# EAGLE design QEDTiny (EAGLE 6.1)
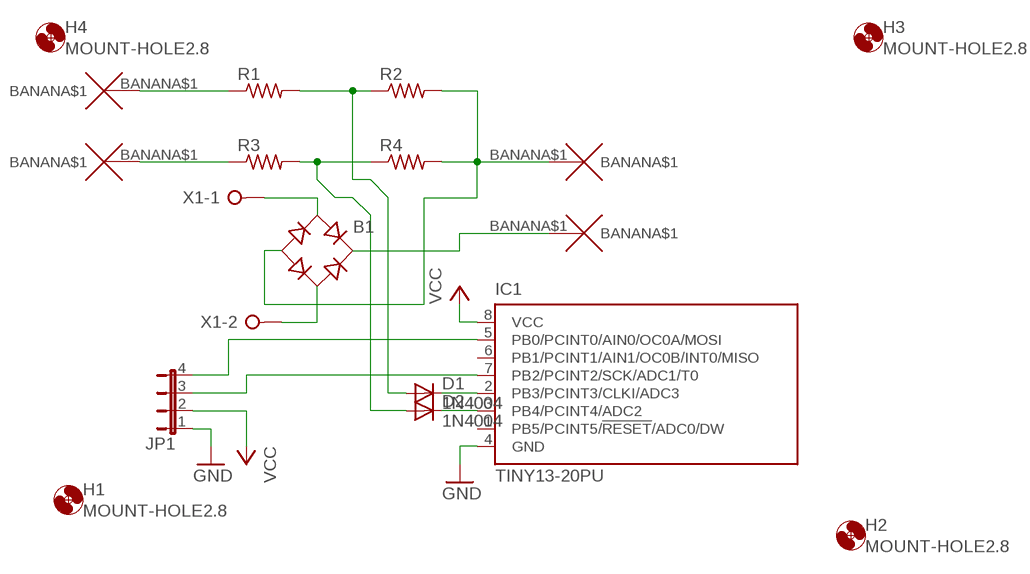
[diagram p0: schematic, sheet 1]

## Parts
B1  RB1A  [RB1A]
D1  1N4004  [DO41-10]
D2  1N4004  [DO41-10]
H1  MOUNT-HOLE2.8  [2,8]
H2  MOUNT-HOLE2.8  [2,8]
H3  MOUNT-HOLE2.8  [2,8]
H4  MOUNT-HOLE2.8  [2,8]
IC1  TINY13-20PU  [DIL08]
JP1  JP4E  [JP4]
R1  R-US_0207/7  [0207/7]
R2  R-US_0207/7  [0207/7]
R3  R-US_0207/7  [0207/7]
R4  R-US_0207/7  [0207/7]
U$1  BANANA  [BANANA]
U$2  BANANA  [BANANA]
U$3  BANANA  [BANANA]
U$4  BANANA  [BANANA]
X1  W237-02P  [W237-132]

## Nets
GND: IC1.4(GND) JP1.1
N$1: IC1.7(PB2/PCINT2/SCK/ADC1/T0) JP1.3
N$2: IC1.5(PB0/PCINT0/AIN0/OC0A/MOSI) JP1.4
N$3: R1.1 U$3.BANANA$1
N$4: R3.1 U$4.BANANA$1
N$5: D1.A R1.2 R2.1
N$6: D2.A R3.2 R4.1
N$7: B1.- R2.2 R4.2 U$2.BANANA$1
N$8: B1.AC1 X1.1
N$9: B1.AC2 X1.2
N$10: B1.+ U$1.BANANA$1
N$11: D1.C IC1.2(PB3/PCINT3/CLKI/ADC3)
N$12: D2.C IC1.3(PB4/PCINT4/ADC2)
VCC: IC1.8(VCC) JP1.2
Unconnected: IC1.1(PB5/PCINT5/!RESET!/ADC0/DW) IC1.6(PB1/PCINT1/AIN1/OC0B/INT0/MISO)

## Library data of the parts
B1 = rectifier:RB1A: RECTIFIER 1 A
D1 D2 = diode:1N4004: DIODE general purpose rectifier, 1 A
H1-H4 = holes:MOUNT-HOLE: MOUNTING HOLE with drill center marker
IC1 = atmel:TINY13: 8-bit AVR Microcontroller with 1K Bytes In-System Programmable Flash Source: http://www.atmel.com/dyn/resources/prod_documents/2535S.pdf; MPN: ATTINY13-20PU; OC_FARNELL: 9171550; OC_NEWARK: 96K6521
JP1 = jumper:JP4E: JUMPER
R1-R4 = rcl:R-US_: RESISTOR, American symbol
U$1-U$4 = wirepad:BANANA
X1 = con-wago-508:W237-02P: WAGO SREW CLAMP; OC_FARNELL: unknown; OC_NEWARK: unknown

## Board
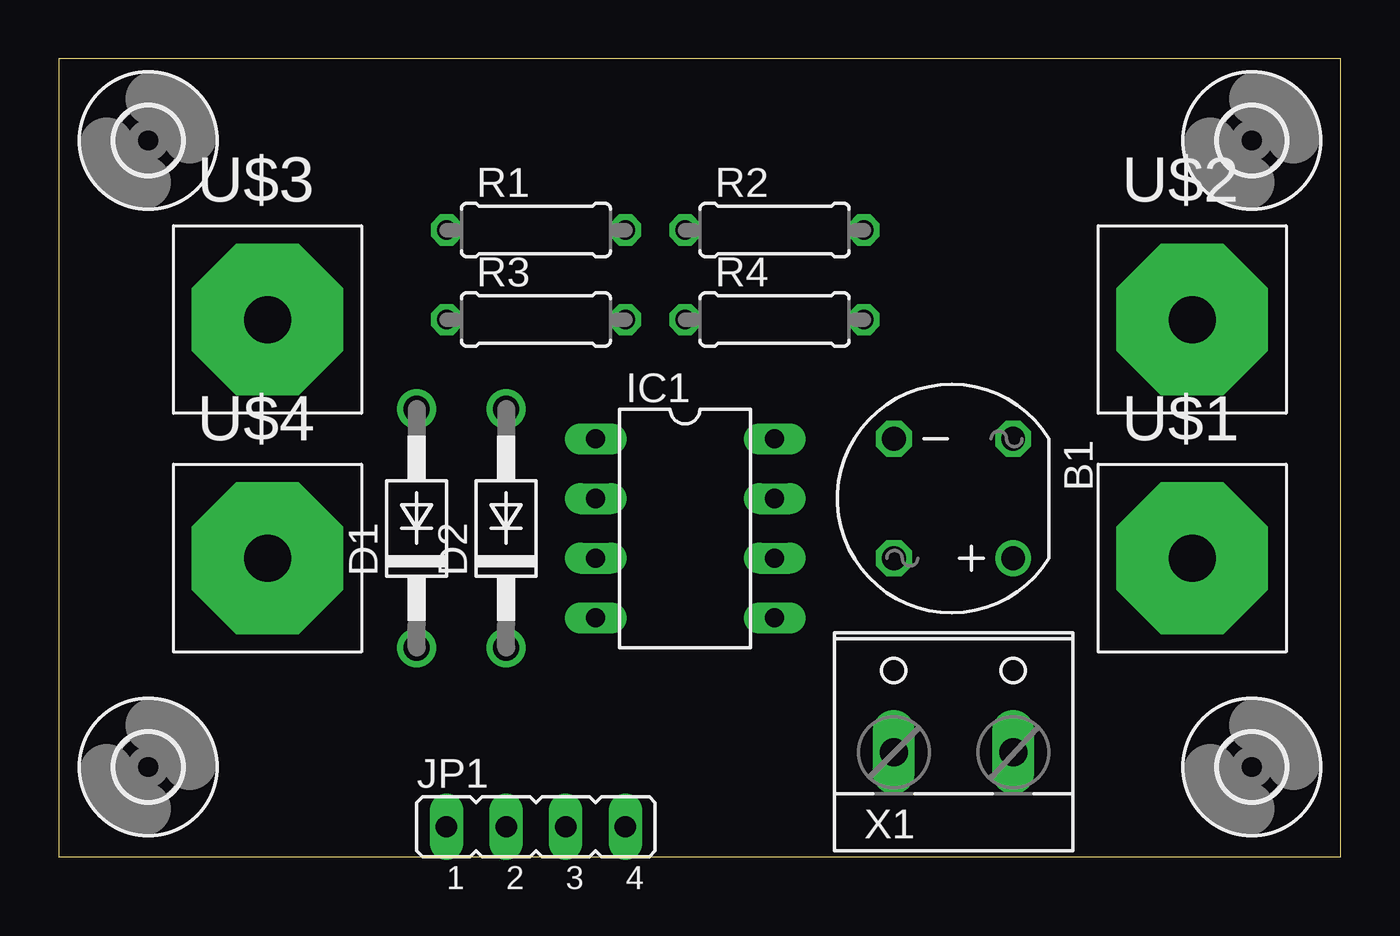
[diagram p1: board, top side]
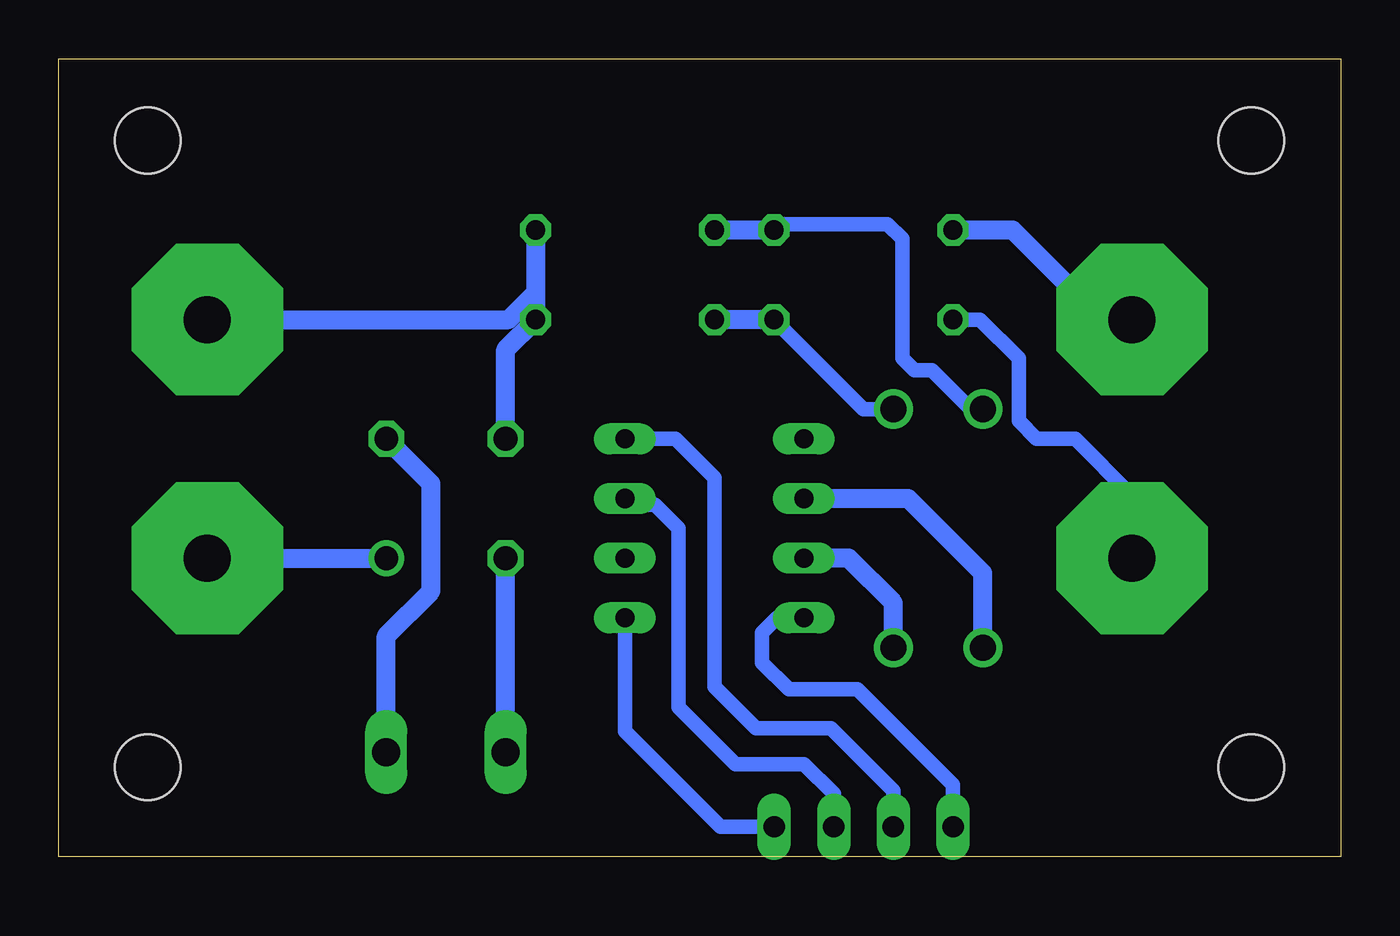
[diagram p2: board, bottom side, seen from below]

Size 54.59 x 33.96 mm. Coordinates in mm from the lower left corner, seen from the top.
Outline: 0,0 54.59,0 54.59,33.96 0,33.96 0,0
Copper layers (1*16): Top 0.035mm / dielectric 1.5mm / Bottom 0.035mm
Design rules: minimum track width 10mil, minimum drill 24mil, track to track 8mil, track to pad 8mil, pad to pad 8mil, via to via 8mil, smd to smd 8mil, copper to edge 40mil, drill to drill 8mil, minimum pad ring 10mil, minimum via ring 8mil, stop-mask expansion 4mil, vias tented up to drill 0mil, thermal gap 10mil

### Footprints (pad centres in the part's own frame; a part is rotated, then mirrored left to right if it is on the bottom)
RB1A = drill 1.016: + -2.54,2.54 | drill 1.016 octagon: - 2.54,-2.54; AC1 2.54,2.54; AC2 -2.54,-2.54
DO41-10 = drill 1.118: A 5.08,0; C -5.08,0
2,8 = hole 2.8: 0,0
DIL08 = drill 0.813 long: 1 -3.81,-3.81; 2 -1.27,-3.81; 3 1.27,-3.81; 4 3.81,-3.81; 5 3.81,3.81; 6 1.27,3.81; 7 -1.27,3.81; 8 -3.81,3.81
JP4 = drill 0.914 long: 1 -3.81,0; 2 -1.27,0; 3 1.27,0; 4 3.81,0
0207/7 = drill 0.813 octagon: 1 -3.81,0; 2 3.81,0
BANANA = drill 2 pad 6.452 octagon: BANANA$1 0,0
W237-132 = drill 1.194 long: 1 -2.54,-0.635; 2 2.54,-0.635

### Placement (x,y rotation side)
B1  38.1,15.24 180 top
D1  15.24,13.97 90 top
D2  19.05,13.97 90 top
H1  3.81,3.81 0 top
H2  50.8,3.81 0 top
H3  3.81,30.48 0 top
H4  50.8,30.48 0 top
IC1  26.67,13.97 270 top
JP1  20.32,1.27 0 top
R1  20.32,26.67 0 top
R2  30.48,26.67 0 top
R3  20.32,22.86 0 top
R4  30.48,22.86 0 top
U$1  48.26,12.7 0 top
U$2  48.26,22.86 0 top
U$3  8.89,22.86 0 top
U$4  8.89,12.7 0 top
X1  38.1,5.08 0 top

### Tracks (layer width: path | path; a pad name or v marks a point on that pad's centre or on a via)
GND
  Bottom 0.61: JP1.1 16.51,3.05 20.57,7.11 23.5,7.11 24.64,8.26 24.64,9.53 24,10.16 IC1.4
N$1
  Bottom 0.61: JP1.3 21.59,2.67 22.86,3.94 25.78,3.94 28.19,6.35 28.19,13.97 29.21,14.99 30.23,14.99 IC1.7
N$2
  Bottom 0.61: JP1.4 26.42,1.27 30.48,5.33 IC1.5
N$3
  Bottom 0.813: U$3.BANANA$1 10.16,22.86 13.97,26.67 R1.1
N$4
  Bottom 0.61: U$4.BANANA$1 8.89,15.37 11.3,17.78 12.95,17.78 13.72,18.54 13.72,21.21 15.37,22.86 R3.1
N$5
  Bottom 0.61: D1.A 15.75,19.05 17.4,20.7 18.16,20.7 18.67,21.21 18.67,26.29 19.3,26.92 23.88,26.92 R1.2
  Bottom 0.813: R1.2 R2.1
N$6
  Bottom 0.61: D2.A 20.32,19.05 R3.2
  Bottom 0.813: R3.2 R4.1
N$7
  Bottom 0.813: R2.2 34.29,24 | 34.29,24 R4.2 35.56,21.59 B1.- | U$2.BANANA$1 35.43,22.86 34.29,24
N$8
  Bottom 0.813: X1.1 B1.AC1
N$9
  Bottom 0.813: X1.2 40.64,9.4 38.73,11.3 38.73,15.88 B1.AC2
N$10
  Bottom 0.813: U$1.BANANA$1 B1.+
N$11
  Bottom 0.813: D1.C 15.24,12.06 18.41,15.24 IC1.2
N$12
  Bottom 0.813: D2.C 19.05,10.79 20.95,12.7 IC1.3
VCC
  Bottom 0.61: JP1.2 19.05,2.79 21.72,5.46 24.89,5.46 26.67,7.24 26.67,16.13 28.32,17.78 IC1.8